# EAGLE design v1m (EAGLE 6.2)
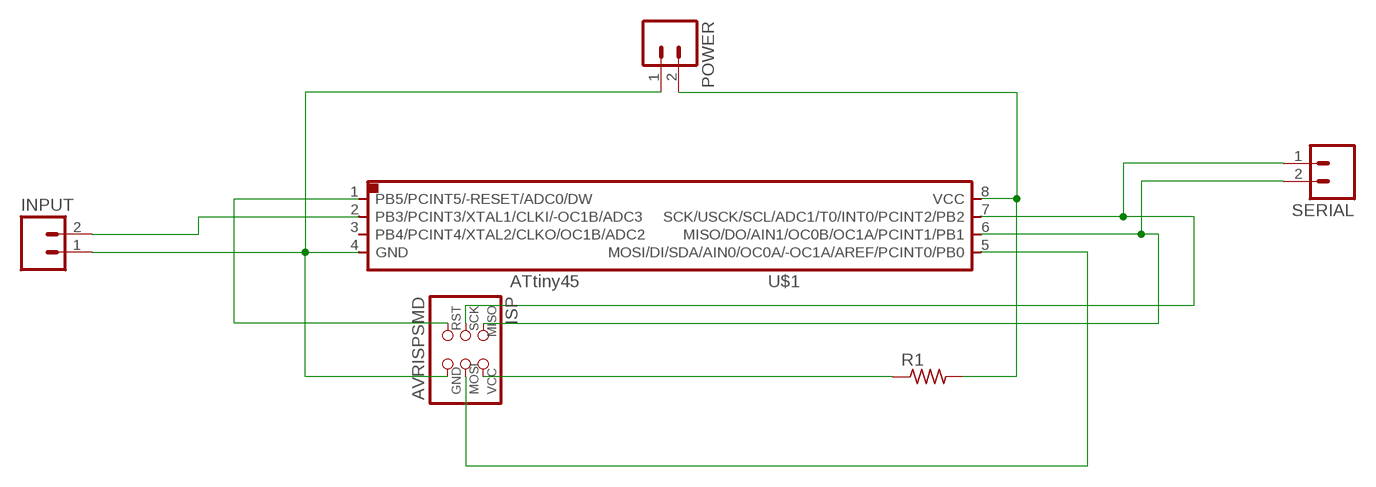
[diagram p0: schematic, sheet 1]

## Parts
INPUT  M02JUST2PADS  [JST-2-SMD-VERT]
ISP  AVRISPSMD  [2X03SMD]
POWER  M02JUST2PADS  [JST-2-SMD-VERT]
R1  RES-US1206  [R1206]
SERIAL  M02JUST2PADS  [JST-2-SMD-VERT]
U$1  ATTINY45SI  [SOIC8]

## Nets
ATTINY45: ISP.3(SCK) SERIAL.1 U$1.7(SCK/USCK/SCL/ADC1/T0/INT0/PCINT2/PB2)
N$1: INPUT.1 ISP.6(GND) POWER.1 U$1.4(GND)
N$2: POWER.2 R1.2 U$1.8(VCC)
N$3: ISP.4(MOSI) U$1.5(MOSI/DI/SDA/AIN0/OC0A/-OC1A/AREF/PCINT0/PB0)
N$4: ISP.1(MISO) SERIAL.2 U$1.6(MISO/DO/AIN1/OC0B/OC1A/PCINT1/PB1)
N$5: ISP.5(RST) U$1.1(PB5/PCINT5/-RESET/ADC0/DW)
N$6: INPUT.2 U$1.2(PB3/PCINT3/XTAL1/CLKI/-OC1B/ADC3)
N$7: ISP.2(VCC) R1.1
Unconnected: U$1.3(PB4/PCINT4/XTAL2/CLKO/OC1B/ADC2)

## Library data of the parts
INPUT POWER SERIAL = Charles-Connectors:M02: Header 2 Standard 2-pin 0.1" header. Use with straight break away headers (SKU : PRT-00116), right angle break away headers (PRT-00553), swiss pins (PRT-00743), machine pins (PRT-00117), and female headers (PRT-00115). Molex polarized connector foot print use with SKU : PRT-08233 with associated crimp pins and housings.
ISP = fab:AVRISP
R1 = fab:RES-US: Resistor (US Symbol) Variants with postfix FAB are widened to allow the routing of internal traces
U$1 = fab:ATTINY45

## Board
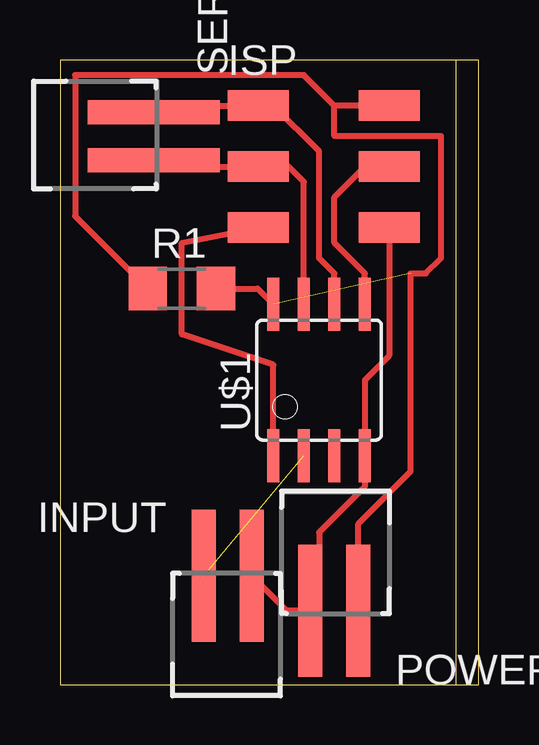
[diagram p1: board, top side]

Size 17.45 x 26.04 mm. Coordinates in mm from the lower left corner, seen from the top.
Outline: 0,0 17.45,0 17.45,26.02 0,26.02 0,0
Copper layers (1*16): Top 0.035mm / dielectric 1.5mm / Bottom 0.035mm
Design rules: minimum track width 10mil, minimum drill 24mil, track to track 8mil, track to pad 8mil, pad to pad 8mil, via to via 8mil, smd to smd 8mil, copper to edge 40mil, drill to drill 8mil, minimum pad ring 10mil, minimum via ring 8mil, stop-mask expansion 4mil, vias tented up to drill 0mil, thermal gap 10mil

### Footprints (pad centres in the part's own frame; a part is rotated, then mirrored left to right if it is on the bottom)
JST-2-SMD-VERT = smd 1 x 5.5: 1 -1,-2; 2 1,-2
2X03SMD = smd 2.54 x 1.27: 1 -2.54,2.54; 2 2.92,2.54; 3 -2.54,0; 4 2.92,0; 5 -2.54,-2.54; 6 2.92,-2.54
R1206 = smd 1.6 x 1.803: 1 -1.422,0; 2 1.422,0
SOIC8 = smd 0.5 x 2.2: 1 -1.905,-3.154; 2 -0.645,-3.154; 3 0.625,-3.154; 4 1.895,-3.154; 5 1.905,3.154; 6 0.635,3.154; 7 -0.635,3.154; 8 -1.905,3.154

### Placement (x,y rotation side)
INPUT  6.99,2.54 180 top
ISP  10.79,21.59 0 top
POWER  11.43,5.08 0 top
R1  5.08,16.51 0 top
SERIAL  1.91,22.86 90 top
U$1  10.79,12.7 0 top

### Tracks (layer width: path | path; a pad name or v marks a point on that pad's centre or on a via)
ATTINY45
  Top 0.254: SERIAL.1 3.17,21.59 ISP.3 9.53,21.59 10.16,20.95 U$1.7
N$1
  Top 0.254: ISP.6 13.71,13.71 12.7,12.7 U$1.4 12.69,8.24 10.79,6.35 10.79,3.44 POWER.1 9.45,3.08 INPUT.1
N$2  (1 unrouted)
  Top 0.254: R1.2 8.23,16.51 U$1.8 | 11.43,24.13 11.43,22.86 15.88,22.86 15.88,17.78 15.24,17.14 14.61,17.14 14.61,8.89 12.43,6.71 POWER.2
N$3
  Top 0.254: U$1.5 12.7,17.14 11.43,18.41 11.43,20.32 12.7,21.59 ISP.4
N$4
  Top 0.254: SERIAL.2 3.17,24.13 ISP.1 8.89,24.13 10.79,22.23 10.79,17.78 11.43,17.14 U$1.6
N$5
  Top 0.254: U$1.1 8.89,13.34 5.08,14.61 5.08,18.41 ISP.5
N$6  (1 unrouted)
  Top 0.254: 10.16,9.54 U$1.2
N$7
  Top 0.254: ISP.2 11.43,24.13 10.16,25.4 0.64,25.4 0.64,19.53 R1.1